# Altium schematic sheet SD_Module.SchDoc
size A; SheetNumber: 3; SheetTotal: 6
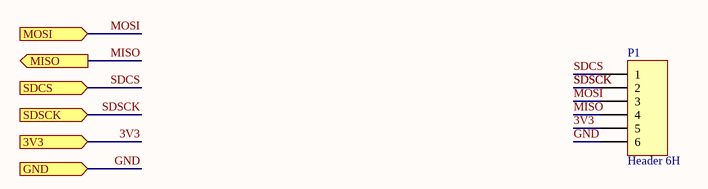
[diagram p0: SD_Module.SchDoc]

## Parts
P1  Header 6H  [HDR1X6H]

## Ports
3V3 (in), GND (in), MISO (out), MOSI (in), SDCS (in), SDSCK (in)

## Nets
3V3: P1.5 ; port 3V3
GND: P1.6 ; port GND
MISO: P1.4 ; port MISO
MOSI: P1.3 ; port MOSI
SDCS: P1.1 ; port SDCS
SDSCK: P1.2 ; port SDSCK

## Library data of the parts
P1 = Header 6H: Header, 6-Pin, Right Angle; LatestRevisionDate: 17-Jul-2002; LatestRevisionNote: Re-released for DXP Platform.; Publisher: Altium Limited